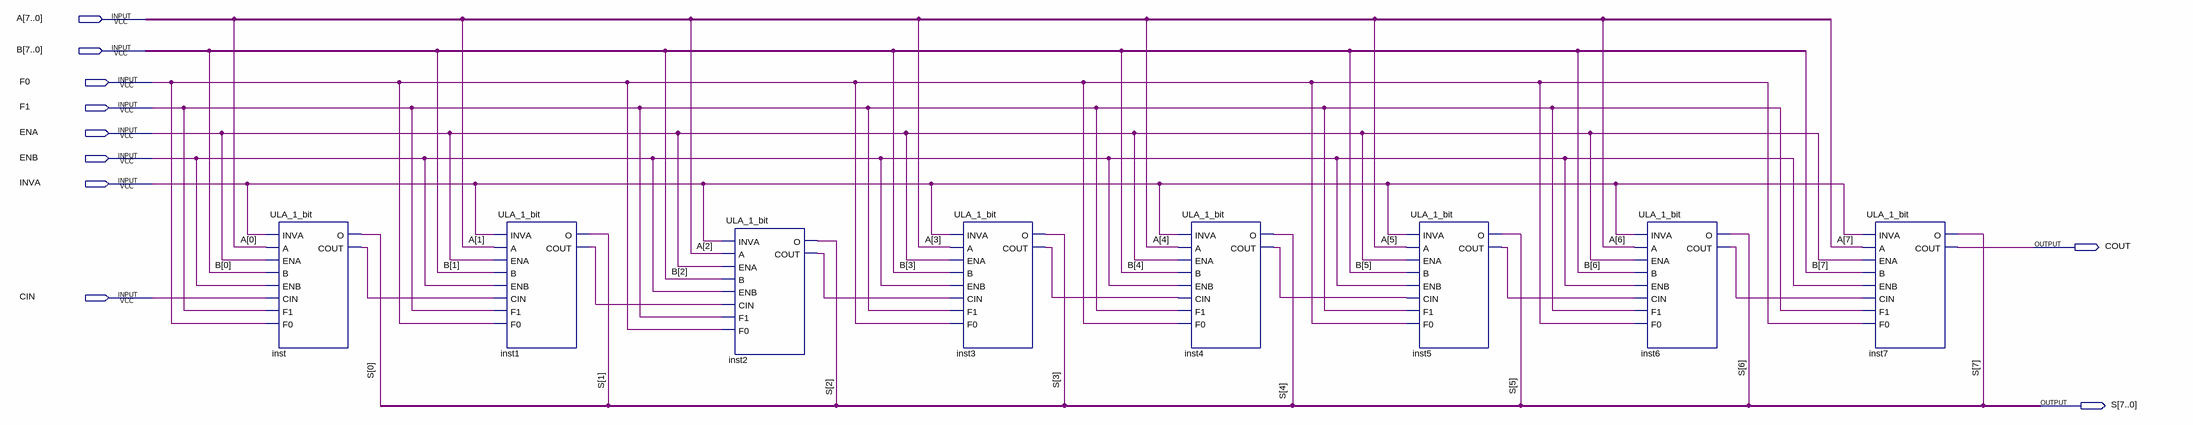
[diagram p0: schematic sheet]
// Quartus schematic ULA_8_bits.bdf as structural Verilog: 8 symbols, 10 pins
module ULA_8_bits (
  input  [7:0] A,
  input  [7:0] B,
  input  F0,
  input  F1,
  input  ENA,
  input  ENB,
  input  INVA,
  input  CIN,
  output COUT,
  output [7:0] S
);

  wire inst1_cout, inst2_cout, inst3_cout, inst4_cout, inst5_cout, inst6_cout, inst_cout;

  ULA_1_bit inst (
    .INVA(INVA), .A(A[0]), .ENA(ENA), .B(B[0]), .ENB(ENB), .CIN(CIN), .F1(F1), .F0(F0), .O(S[0]),
    .COUT(inst_cout));
  ULA_1_bit inst1 (
    .INVA(INVA), .A(A[1]), .ENA(ENA), .B(B[1]), .ENB(ENB), .CIN(inst_cout), .F1(F1), .F0(F0), .O(S[1]),
    .COUT(inst1_cout));
  ULA_1_bit inst2 (
    .INVA(INVA), .A(A[2]), .ENA(ENA), .B(B[2]), .ENB(ENB), .CIN(inst1_cout), .F1(F1), .F0(F0), .O(S[2]),
    .COUT(inst2_cout));
  ULA_1_bit inst3 (
    .INVA(INVA), .A(A[3]), .ENA(ENA), .B(B[3]), .ENB(ENB), .CIN(inst2_cout), .F1(F1), .F0(F0), .O(S[3]),
    .COUT(inst3_cout));
  ULA_1_bit inst4 (
    .INVA(INVA), .A(A[4]), .ENA(ENA), .B(B[4]), .ENB(ENB), .CIN(inst3_cout), .F1(F1), .F0(F0), .O(S[4]),
    .COUT(inst4_cout));
  ULA_1_bit inst5 (
    .INVA(INVA), .A(A[5]), .ENA(ENA), .B(B[5]), .ENB(ENB), .CIN(inst4_cout), .F1(F1), .F0(F0), .O(S[5]),
    .COUT(inst5_cout));
  ULA_1_bit inst6 (
    .INVA(INVA), .A(A[6]), .ENA(ENA), .B(B[6]), .ENB(ENB), .CIN(inst5_cout), .F1(F1), .F0(F0), .O(S[6]),
    .COUT(inst6_cout));
  ULA_1_bit inst7 (
    .INVA(INVA), .A(A[7]), .ENA(ENA), .B(B[7]), .ENB(ENB), .CIN(inst6_cout), .F1(F1), .F0(F0), .O(S[7]),
    .COUT(COUT));
endmodule
